# Altium schematic sheet Xilinx_pwr.SchDoc
size A3; Author: Швецов С.В.; Organization: PapuaSoft; SheetNumber: 6; SheetTotal: 8
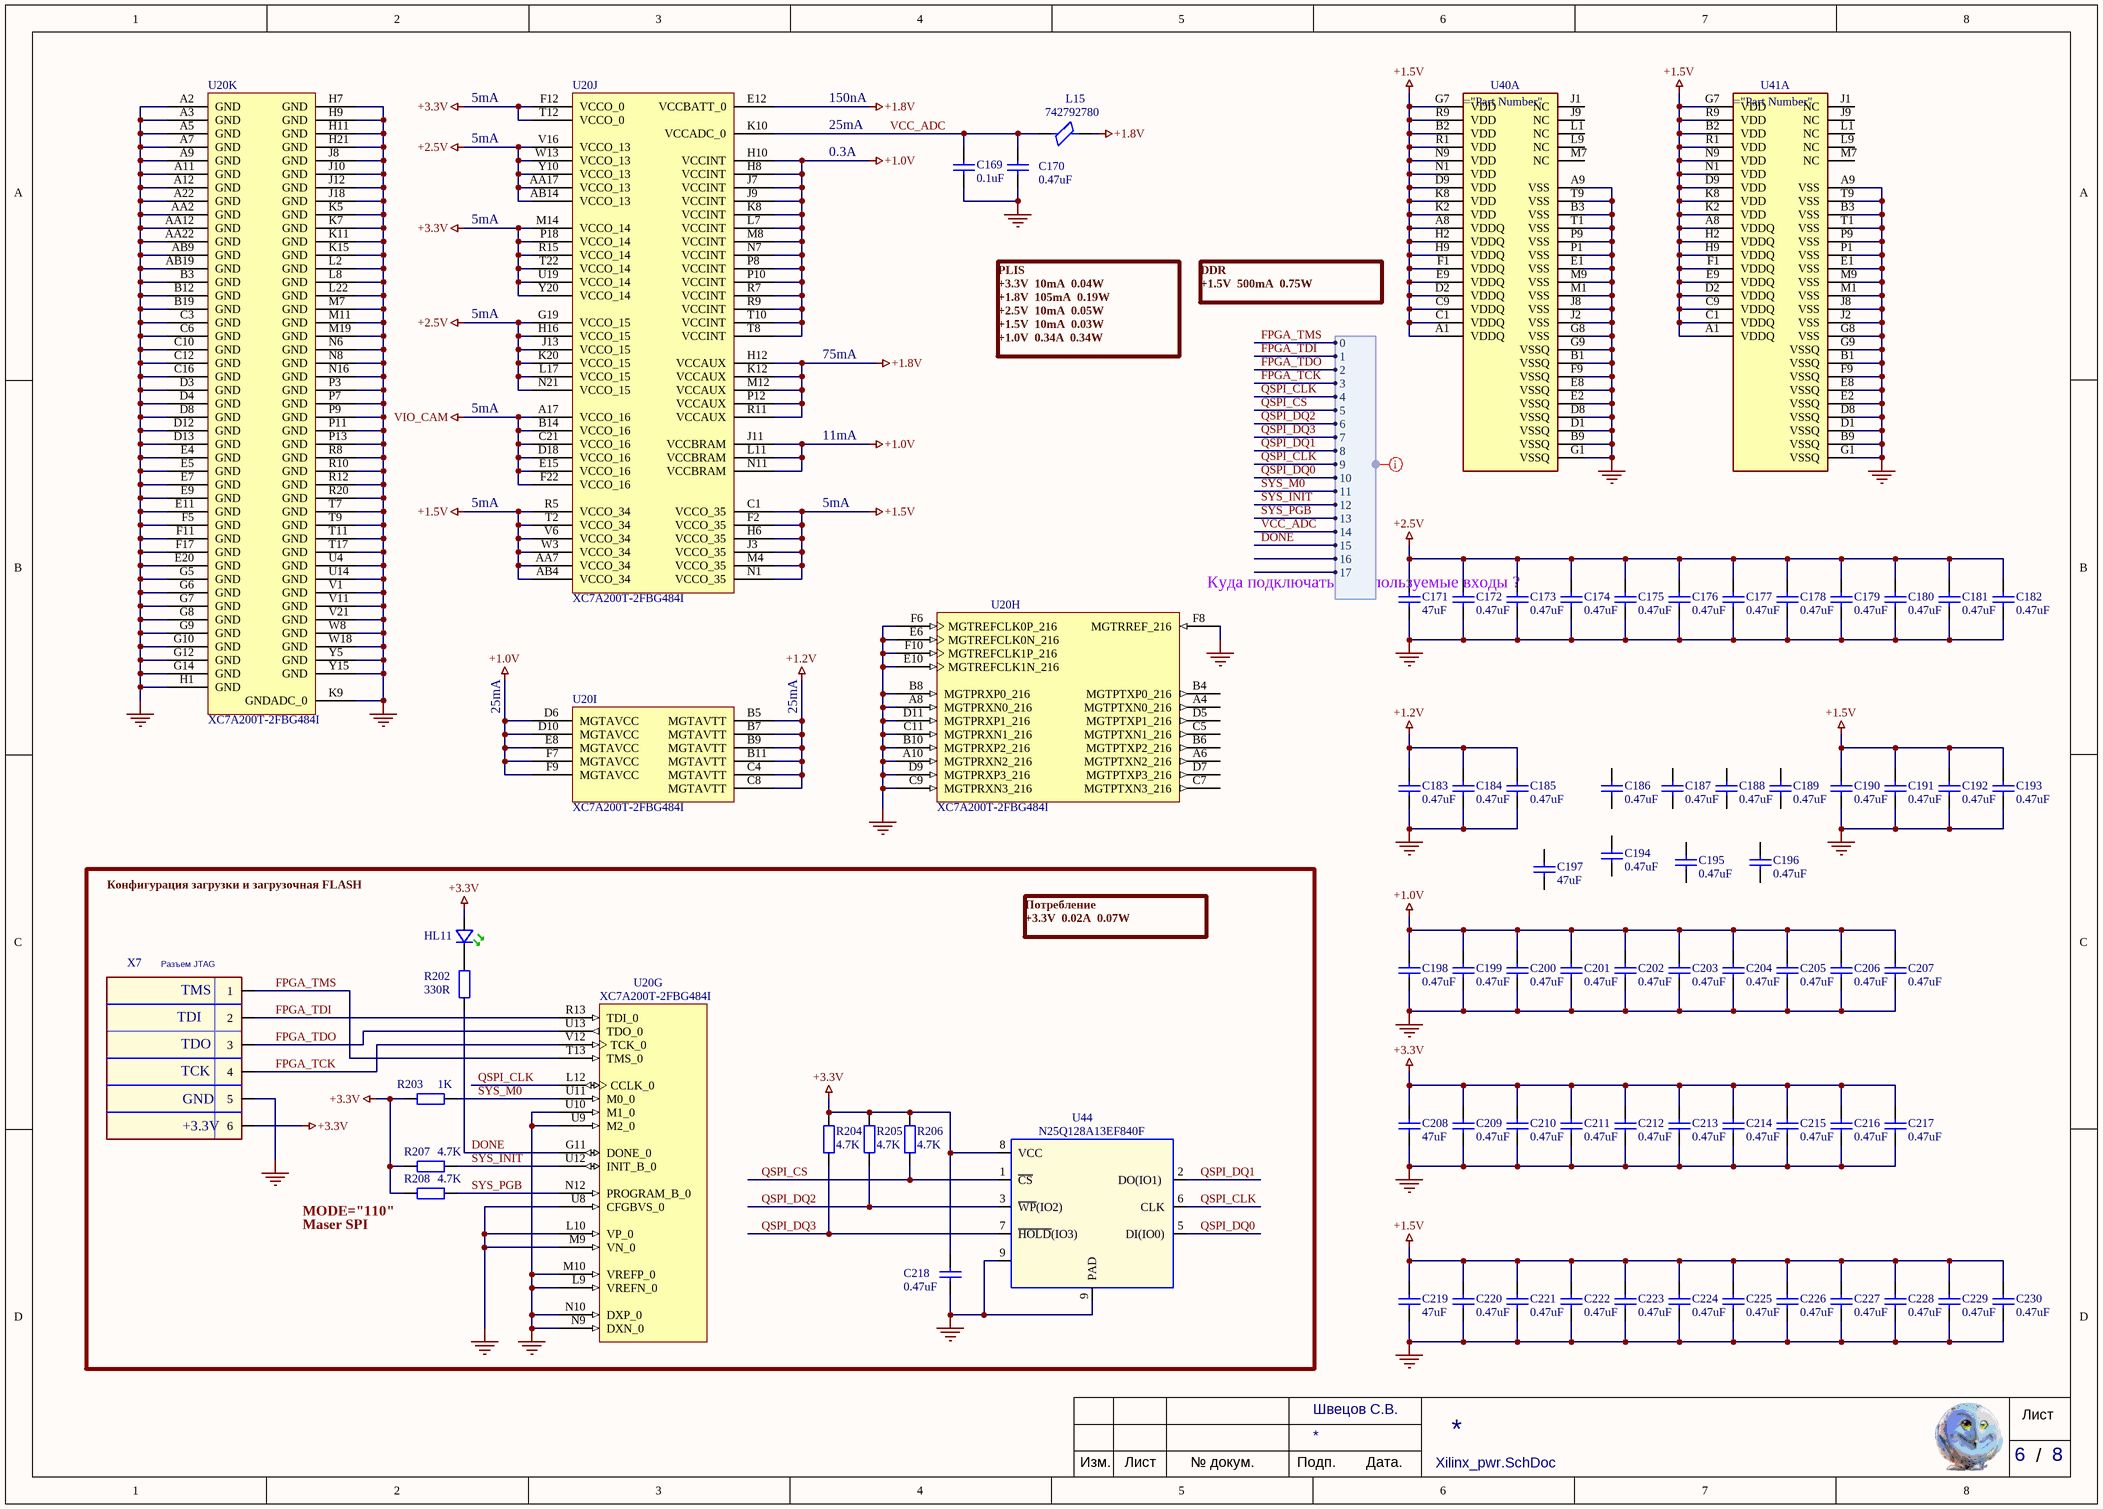
[diagram p0: Xilinx_pwr.SchDoc]

## Parts
C169  value 0.1uF  [C0402]  (hidden comment: Cap)
C170  value 0.47uF  [C0402]  (hidden comment: Cap)
C171  value 47uF  [C0805]  (hidden comment: Cap)
C172  value 0.47uF  [C0402]  (hidden comment: Cap)
C173  value 0.47uF  [C0402]  (hidden comment: Cap)
C174  value 0.47uF  [C0402]  (hidden comment: Cap)
C175  value 0.47uF  [C0402]  (hidden comment: Cap)
C176  value 0.47uF  [C0402]  (hidden comment: Cap)
C177  value 0.47uF  [C0402]  (hidden comment: Cap)
C178  value 0.47uF  [C0402]  (hidden comment: Cap)
C179  value 0.47uF  [C0402]  (hidden comment: Cap)
C180  value 0.47uF  [C0402]  (hidden comment: Cap)
C181  value 0.47uF  [C0402]  (hidden comment: Cap)
C182  value 0.47uF  [C0402]  (hidden comment: Cap)
C183  value 0.47uF  [C0402]  (hidden comment: Cap)
C184  value 0.47uF  [C0402]  (hidden comment: Cap)
C185  value 0.47uF  [C0402]  (hidden comment: Cap)
C186  value 0.47uF  [C0402]  (hidden comment: Cap)
C187  value 0.47uF  [C0402]  (hidden comment: Cap)
C188  value 0.47uF  [C0402]  (hidden comment: Cap)
C189  value 0.47uF  [C0402]  (hidden comment: Cap)
C190  value 0.47uF  [C0402]  (hidden comment: Cap)
C191  value 0.47uF  [C0402]  (hidden comment: Cap)
C192  value 0.47uF  [C0402]  (hidden comment: Cap)
C193  value 0.47uF  [C0402]  (hidden comment: Cap)
C194  value 0.47uF  [C0402]  (hidden comment: Cap)
C195  value 0.47uF  [C0402]  (hidden comment: Cap)
C196  value 0.47uF  [C0402]  (hidden comment: Cap)
C197  value 47uF  [C0805]  (hidden comment: Cap)
C198  value 0.47uF  [C0402]  (hidden comment: Cap)
C199  value 0.47uF  [C0402]  (hidden comment: Cap)
C200  value 0.47uF  [C0402]  (hidden comment: Cap)
C201  value 0.47uF  [C0402]  (hidden comment: Cap)
C202  value 0.47uF  [C0402]  (hidden comment: Cap)
C203  value 0.47uF  [C0402]  (hidden comment: Cap)
C204  value 0.47uF  [C0402]  (hidden comment: Cap)
C205  value 0.47uF  [C0402]  (hidden comment: Cap)
C206  value 0.47uF  [C0402]  (hidden comment: Cap)
C207  value 0.47uF  [C0402]  (hidden comment: Cap)
C208  value 47uF  [C0805]  (hidden comment: Cap)
C209  value 0.47uF  [C0402]  (hidden comment: Cap)
C210  value 0.47uF  [C0402]  (hidden comment: Cap)
C211  value 0.47uF  [C0402]  (hidden comment: Cap)
C212  value 0.47uF  [C0402]  (hidden comment: Cap)
C213  value 0.47uF  [C0402]  (hidden comment: Cap)
C214  value 0.47uF  [C0402]  (hidden comment: Cap)
C215  value 0.47uF  [C0402]  (hidden comment: Cap)
C216  value 0.47uF  [C0402]  (hidden comment: Cap)
C217  value 0.47uF  [C0402]  (hidden comment: Cap)
C218  value 0.47uF  [C0402]  (hidden comment: Cap)
C219  value 47uF  [C0805]  (hidden comment: Cap)
C220  value 0.47uF  [C0402]  (hidden comment: Cap)
C221  value 0.47uF  [C0402]  (hidden comment: Cap)
C222  value 0.47uF  [C0402]  (hidden comment: Cap)
C223  value 0.47uF  [C0402]  (hidden comment: Cap)
C224  value 0.47uF  [C0402]  (hidden comment: Cap)
C225  value 0.47uF  [C0402]  (hidden comment: Cap)
C226  value 0.47uF  [C0402]  (hidden comment: Cap)
C227  value 0.47uF  [C0402]  (hidden comment: Cap)
C228  value 0.47uF  [C0402]  (hidden comment: Cap)
C229  value 0.47uF  [C0402]  (hidden comment: Cap)
C230  value 0.47uF  [C0402]  (hidden comment: Cap)
HL11  (no value)  [KP-1608_16x08x11_L]
L15  742792780  [L0402]
R202  value 330R  [R0402]  (hidden comment: Res2)
R203  value 1K  [R0402]  (hidden comment: Res2)
R204  value 4.7K  [R0402]  (hidden comment: Res2)
R205  value 4.7K  [R0402]  (hidden comment: Res2)
R206  value 4.7K  [R0402]  (hidden comment: Res2)
R207  value 4.7K  [R0402]  (hidden comment: Res2)
R208  value 4.7K  [R0402]  (hidden comment: Res2)
U20  XC7A200T-2FBG484I  [FBG484]  (parts G,H,I,J,K of 11)
U40  MT41J256M16HA-125-E  [FBGA96_9X14_MRN]  (value not drawn)  (part A of 2)
U41  MT41J256M16HA-125-E  [FBGA96_9X14_MRN]  (value not drawn)  (part A of 2)
U44  N25Q128A13EF840F  [VPDFN8_8X6_MRN-L]
X7  Разъем JTAG  [HEADER-1X6S]

## Harnesses
SYSTEM: 0, 1, 2, 3, 4, 5, 6, 7, 8, 9, 11, 12, 10, 13, 14, 15, 16, 17

## Nets
+1.0V: C198.1 C199.1 C200.1 C201.1 C202.1 C203.1 C204.1 C205.1 C206.1 C207.1 U20.D6(MGTAVCC) U20.D10(MGTAVCC) U20.E8(MGTAVCC) U20.F7(MGTAVCC) U20.F9(MGTAVCC) U20.H8(VCCINT) U20.H10(VCCINT) U20.J7(VCCINT) U20.J9(VCCINT) U20.J11(VCCBRAM) U20.K8(VCCINT) U20.L7(VCCINT) U20.L11(VCCBRAM) U20.M8(VCCINT) U20.N7(VCCINT) U20.N11(VCCBRAM) U20.P8(VCCINT) U20.P10(VCCINT) U20.R7(VCCINT) U20.R9(VCCINT) U20.T8(VCCINT) U20.T10(VCCINT)
+1.2V: C183.1 C184.1 C185.1 U20.B5(MGTAVTT) U20.B7(MGTAVTT) U20.B9(MGTAVTT) U20.B11(MGTAVTT) U20.C4(MGTAVTT) U20.C8(MGTAVTT)
+1.5V: C190.1 C191.1 C192.1 C193.1 C219.1 C220.1 C221.1 C222.1 C223.1 C224.1 C225.1 C226.1 C227.1 C228.1 C229.1 C230.1 U20.AA7(VCCO_34) U20.AB4(VCCO_34) U20.C1(VCCO_35) U20.F2(VCCO_35) U20.H6(VCCO_35) U20.J3(VCCO_35) U20.M4(VCCO_35) U20.N1(VCCO_35) U20.R5(VCCO_34) U20.T2(VCCO_34) U20.V6(VCCO_34) U20.W3(VCCO_34) U40.A1(VDDQ) U40.A8(VDDQ) U40.B2(VDD) U40.C1(VDDQ) U40.C9(VDDQ) U40.D2(VDDQ) U40.D9(VDD) U40.E9(VDDQ) U40.F1(VDDQ) U40.G7(VDD) U40.H2(VDDQ) U40.H9(VDDQ) U40.K2(VDD) U40.K8(VDD) U40.N1(VDD) U40.N9(VDD) U40.R1(VDD) U40.R9(VDD) U41.A1(VDDQ) U41.A8(VDDQ) U41.B2(VDD) U41.C1(VDDQ) U41.C9(VDDQ) U41.D2(VDDQ) U41.D9(VDD) U41.E9(VDDQ) U41.F1(VDDQ) U41.G7(VDD) U41.H2(VDDQ) U41.H9(VDDQ) U41.K2(VDD) U41.K8(VDD) U41.N1(VDD) U41.N9(VDD) U41.R1(VDD) U41.R9(VDD)
+1.8V: L15.2 U20.E12(VCCBATT_0) U20.H12(VCCAUX) U20.K12(VCCAUX) U20.M12(VCCAUX) U20.P12(VCCAUX) U20.R11(VCCAUX)
+2.5V: C171.1 C172.1 C173.1 C174.1 C175.1 C176.1 C177.1 C178.1 C179.1 C180.1 C181.1 C182.1 U20.AA17(VCCO_13) U20.AB14(VCCO_13) U20.G19(VCCO_15) U20.H16(VCCO_15) U20.J13(VCCO_15) U20.K20(VCCO_15) U20.L17(VCCO_15) U20.N21(VCCO_15) U20.V16(VCCO_13) U20.W13(VCCO_13) U20.Y10(VCCO_13)
+3.3V: C208.1 C209.1 C210.1 C211.1 C212.1 C213.1 C214.1 C215.1 C216.1 C217.1 C218.1 HL11.1(Anode) R203.1 R204.2 R205.2 R206.2 R207.1 R208.1 U20.F12(VCCO_0) U20.M14(VCCO_14) U20.P18(VCCO_14) U20.R15(VCCO_14) U20.T12(VCCO_0) U20.T22(VCCO_14) U20.U19(VCCO_14) U20.Y20(VCCO_14) U44.8(VCC) X7.6
GND: C169.2 C170.2 C171.2 C172.2 C173.2 C174.2 C175.2 C176.2 C177.2 C178.2 C179.2 C180.2 C181.2 C182.2 C183.2 C184.2 C185.2 C190.2 C191.2 C192.2 C193.2 C198.2 C199.2 C200.2 C201.2 C202.2 C203.2 C204.2 C205.2 C206.2 C207.2 C208.2 C209.2 C210.2 C211.2 C212.2 C213.2 C214.2 C215.2 C216.2 C217.2 C218.2 C219.2 C220.2 C221.2 C222.2 C223.2 C224.2 C225.2 C226.2 C227.2 C228.2 C229.2 C230.2 U20.A2(GND) U20.A3(GND) U20.A5(GND) U20.A7(GND) U20.A8(MGTPRXN0_216) U20.A9(GND) U20.A10(MGTPRXN2_216) U20.A11(GND) U20.A12(GND) U20.A22(GND) U20.AA2(GND) U20.AA12(GND) U20.AA22(GND) U20.AB9(GND) U20.AB19(GND) U20.B3(GND) U20.B8(MGTPRXP0_216) U20.B10(MGTPRXP2_216) U20.B12(GND) U20.B19(GND) U20.C3(GND) U20.C6(GND) U20.C9(MGTPRXN3_216) U20.C10(GND) U20.C11(MGTPRXN1_216) U20.C12(GND) U20.C16(GND) U20.D3(GND) U20.D4(GND) U20.D8(GND) U20.D9(MGTPRXP3_216) U20.D11(MGTPRXP1_216) U20.D12(GND) U20.D13(GND) U20.E4(GND) U20.E5(GND) U20.E6(MGTREFCLK0N_216) U20.E7(GND) U20.E9(GND) U20.E10(MGTREFCLK1N_216) U20.E11(GND) U20.E20(GND) U20.F5(GND) U20.F6(MGTREFCLK0P_216) U20.F8(MGTRREF_216) U20.F10(MGTREFCLK1P_216) U20.F11(GND) U20.F17(GND) U20.G5(GND) U20.G6(GND) U20.G7(GND) U20.G8(GND) U20.G9(GND) U20.G10(GND) U20.G12(GND) U20.G14(GND) U20.H1(GND) U20.H7(GND) U20.H9(GND) U20.H11(GND) U20.H21(GND) U20.J8(GND) U20.J10(GND) U20.J12(GND) U20.J18(GND) U20.K5(GND) U20.K7(GND) U20.K9(GNDADC_0) U20.K11(GND) U20.K15(GND) U20.L2(GND) U20.L8(GND) U20.L9(VREFN_0) U20.L10(VP_0) U20.L22(GND) U20.M7(GND) U20.M9(VN_0) U20.M10(VREFP_0) U20.M11(GND) U20.M19(GND) U20.N6(GND) U20.N8(GND) U20.N9(DXN_0) U20.N10(DXP_0) U20.N16(GND) U20.P3(GND) U20.P7(GND) U20.P9(GND) U20.P11(GND) U20.P13(GND) U20.R8(GND) U20.R10(GND) U20.R12(GND) U20.R20(GND) U20.T7(GND) U20.T9(GND) U20.T11(GND) U20.T17(GND) U20.U4(GND) U20.U8(CFGBVS_0) U20.U9(M2_0) U20.U10(M1_0) U20.U14(GND) U20.V1(GND) U20.V11(GND) U20.V21(GND) U20.W8(GND) U20.W18(GND) U20.Y5(GND) U20.Y15(GND) U40.A9(VSS) U40.B1(VSSQ) U40.B3(VSS) U40.B9(VSSQ) U40.D1(VSSQ) U40.D8(VSSQ) U40.E1(VSS) U40.E2(VSSQ) U40.E8(VSSQ) U40.F9(VSSQ) U40.G1(VSSQ) U40.G8(VSS) U40.G9(VSSQ) U40.J2(VSS) U40.J8(VSS) U40.M1(VSS) U40.M9(VSS) U40.P1(VSS) U40.P9(VSS) U40.T1(VSS) U40.T9(VSS) U41.A9(VSS) U41.B1(VSSQ) U41.B3(VSS) U41.B9(VSSQ) U41.D1(VSSQ) U41.D8(VSSQ) U41.E1(VSS) U41.E2(VSSQ) U41.E8(VSSQ) U41.F9(VSSQ) U41.G1(VSSQ) U41.G8(VSS) U41.G9(VSSQ) U41.J2(VSS) U41.J8(VSS) U41.M1(VSS) U41.M9(VSS) U41.P1(VSS) U41.P9(VSS) U41.T1(VSS) U41.T9(VSS) U44.9 X7.5
VIO_CAM: U20.A17(VCCO_16) U20.B14(VCCO_16) U20.C21(VCCO_16) U20.D18(VCCO_16) U20.E15(VCCO_16) U20.F22(VCCO_16)
DONE: R202.1 U20.G11(DONE_0) ; harness SYSTEM.15
FPGA_TCK: U20.V12(TCK_0) X7.4 ; harness SYSTEM.3
FPGA_TDI: U20.R13(TDI_0) X7.2 ; harness SYSTEM.1
FPGA_TDO: U20.U13(TDO_0) X7.3 ; harness SYSTEM.2
FPGA_TMS: U20.T13(TMS_0) X7.1 ; harness SYSTEM.0
QSPI_CLK: U20.L12(CCLK_0) U44.6(CLK) ; harness SYSTEM.4, harness SYSTEM.9
QSPI_CS: R206.1 U44.1(~{CS}) ; harness SYSTEM.5
QSPI_DQ0: U44.5(DI(IO0)) ; harness SYSTEM.10
QSPI_DQ1: U44.2(DO(IO1)) ; harness SYSTEM.8
QSPI_DQ2: R205.1 U44.3(~{WP}(IO2)) ; harness SYSTEM.6
QSPI_DQ3: R204.1 U44.7(~{HOLD}(IO3)) ; harness SYSTEM.7
SYS_INIT: R207.2 U20.U12(INIT_B_0) ; harness SYSTEM.12
SYS_M0: R203.2 U20.U11(M0_0) ; harness SYSTEM.11
SYS_PGB: R208.2 U20.N12(PROGRAM_B_0) ; harness SYSTEM.13
VCC_ADC: C169.1 C170.1 L15.1 U20.K10(VCCADC_0) ; harness SYSTEM.14
NetHL11_2: HL11.2(Cathode) R202.2

Not connected (* = marked no-connect by the designer): C186 1 2; C187 1 2; C188 1 2; C189 1 2; C194 1 2; C195 1 2; C196 1 2; C197 1 2; U20 A4(MGTPTXN0_216) A6(MGTPTXN2_216) B4(MGTPTXP0_216) B6(MGTPTXP2_216) C5(MGTPTXN1_216) C7(MGTPTXN3_216) D5(MGTPTXP1_216) D7(MGTPTXP3_216); U40 J1(NC) J9(NC) L1(NC) L9(NC) M7(NC); U41 J1(NC) J9(NC) L1(NC) L9(NC) M7(NC)

## Layout directives
net class PLIS_SYS: (no net found under the mark)

## Notes on the sheet
- 5mA
- 150nA
- 25mA
- 0.3A
- DDR
  +1.5V  500mA  0.75W
- 75mA
- PLIS
  +3.3V  10mA  0.04W
  +1.8V  105mA  0.19W
  +2.5V  10mA  0.05W
  +1.5V  10mA  0.03W
  +1.0V  0.34A  0.34W
- 11mA
- (near U20) Куда подключать неиспользуемые входы ?
- (near U20) 25mA
- Конфигурация загрузки и загрузочная FLASH
- Потребление
  +3.3V  0.02A  0.07W
- TDI
- TMS
- TDO
- TCK
- GND
- +3.3V
- MODE="110"
- Maser SPI
- Лист
- /
- Изм.
- № докум.
- Подп.
- Дата.

## Library data of the parts
C169 = Cap: Конденсатор керамический; Voltage: 25V; PackageReference: 0402; ClassName: Xilinx PWR
C170 C172-C196 C198-C207 C209-C218 C220-C230 = Cap: Конденсатор керамический; Voltage: 10V; PackageReference: 0402; ClassName: Xilinx PWR
C171 C197 C208 C219 = Cap: C0805C476M9PAC; Voltage: 6.3V; PackageReference: 0805; ClassName: Xilinx PWR
HL11 = ledG_KP-1608MGC_KP-1608: 1.6X0.8mm SMD  LED; LxWxH(mm): 1,6x0,8x1,1; Value: KP-1608MGC; PackageReference: 0603; Package: KP-1608_16x08x11; ClassName: Xilinx_SYS
L15 = BEAD_FERRITE_SM: Wurth Elektronik EMI FILTERS FERRITE BEAD, 220R@100MHz, 0.35R; PackageReference: 0402; Value: 742792780; ClassName: Xilinx PWR
R202-R208 = Res2: Резистор; PackageReference: 0402; ClassName: Xilinx_SYS
U20 = XC7A200T-2FBG484I: Artix-7 FPGA, 285 User I/Os, 4 GTP, 484-Ball BGA; Manufacturer: Xilinx; CLBs (Slices): 33650; DSP48E1 Slices: 740; Block RAM Blocks (36Kb): 365; Logic Cells: 215360; Block RAM Blocks (Max Kb): 13140; Speed Grade: -2; Clock Mgmt Tiles (CMTs): 10; Block RAM Blocks (18Kb): 730; Max User I/O: 500; ComponentLink5Description: Packaging and Pinout; CLBs (Max Distributed RAM Kb): 2888; ComponentLink4Description: Package File; ComponentLink5URL: http://www.xilinx.com/support/documentation/user_guides/ug475_7Series_Pkg_Pinout.pdf; ComponentLink1Description: Datasheet; ComponentLink2Description: Package Specification; DatasheetVersion: v1.12; ComponentLink3URL: http://www.xilinx.com/support/documentation/data_sheets/ds181_Artix_7_Data_Sheet.pdf; ComponentLink1URL: http://www.xilinx.com/support/documentation/data_sheets/ds180_7Series_Overview.pdf; Code_JEDEC: MS-034; ComponentLink2URL: http://www.xilinx.com/support/documentation/user_guides/ug475_7Series_Pkg_Pinout.pdf; ComponentLink3Description: DC and Switching Characteristics; Generic Part Number: XC7A200T; RoHS: Pb-Free; ComponentLink4URL: http://www.xilinx.com/support/packagefiles/a7packages/xc7a200tfbg484pkg.txt; PackageVersion: Rev 1.8; Mounting Technology: Surface Mount; PackageReference: FBG484; PackageDescription: Flip-Chip Lidless BGA, Body 23 x 23 mm, 1.0 mm Pitch; Value: XC7A200T-2FBG484I; ClassName: *
U40 U41 = MT41J256M16HA-125-E: DDR3 SDRAM 32Meg x 16 x 8 banks; Value: MT41J256M16HA-125-E; PackageReference: FBGA-96
U44 = N25Q128A13EF840F: Serial NOR Flash 128Mb 3V; Value: N25Q128A13EF840F; PackageReference: MLP8; ClassName: Xilinx_SYS
X7 = CON1x6: Value: CON1x6; ClassName: Xilinx_SYS